# Altium schematic sheet Sourse.SchDoc
size A4
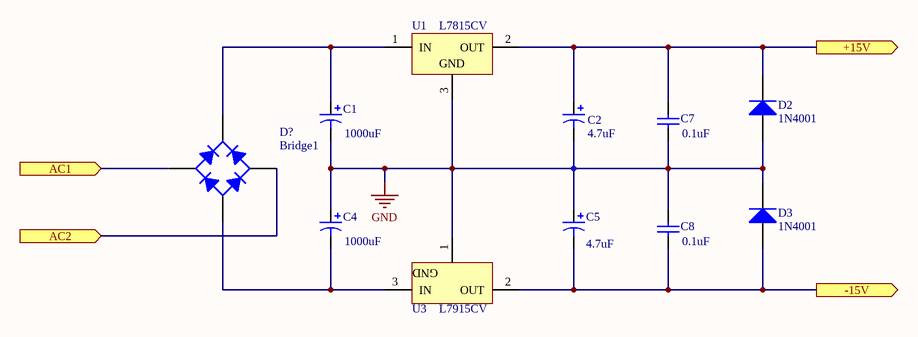
[diagram p0: Sourse.SchDoc]

## Parts
C1  value 1000uF  [RB7.6-15]  (hidden comment: Cap Pol1)
C2  value 4.7uF  [RB7.6-15]  (hidden comment: Cap Pol1)
C4  value 1000uF  [RB7.6-15]  (hidden comment: Cap Pol1)
C5  value 4.7uF  [RB7.6-15]  (hidden comment: Cap Pol1)
C7  value 0.1uF  [RAD-0.3]  (hidden comment: Cap)
C8  value 0.1uF  [RAD-0.3]  (hidden comment: Cap)
D2  1N4001  [DO-41]
D3  1N4001  [DO-41]
D?  Bridge1  [D-38]
U1  L7815CV  [TO220ABN]
U3  L7915CV  [TO220V]

## Ports
+15V (out), -15V (out), AC1 (in), AC2 (in)

## Nets
GND: C1.2 C2.2 C4.1 C5.1 C7.2 C8.1 D2.1(A) D3.2(K) U1.3(GND) U3.1(GND)
+15V: C2.1 C7.1 D2.2(K) U1.2(OUT) ; port +15V
-15V: C5.2 C8.2 D3.1(A) U3.2(OUT) ; port -15V
AC1: D?.2(C) ; port AC1
AC2: D?.4(C) ; port AC2
NetC1_1: C1.1 D?.3(K) U1.1(IN)
NetC4_2: C4.2 D?.1(A) U3.3(IN)

## Library data of the parts
C1 C2 C4 C5 = Cap Pol1: Polarized Capacitor (Radial); Published: 8-Jun-2000; LatestRevisionDate: 17-Jul-2002; LatestRevisionNote: Re-released for DXP Platform.; PackageReference: RB7.6-15; Publisher: Altium Limited
C7 C8 = Cap: Capacitor; Published: 8-Jun-2000; LatestRevisionDate: 17-Jul-2002; LatestRevisionNote: Re-released for DXP Platform.; PackageReference: RAD-0.3; Publisher: Altium Limited
D2 D3 = Diode 1N4001: 1 Amp General Purpose Rectifier; Published: 8-Jun-2000; LatestRevisionDate: 17-Jul-2002; LatestRevisionNote: Re-released for DXP Platform.; DatasheetDocument: 1998; PackageDocument: Aug-1999; PackageReference: DO-41; Publisher: Altium Limited; Code_JEDEC: DO-204-AL; ComponentLink1Description: Manufacturer Link; ComponentLink1URL: http://www.fairchildsemi.com/; ComponentLink2Description: Datasheet; ComponentLink2URL: http://www.fairchildsemi.com/ds/1N%2F1N4001.pdf
D? = Bridge1: Full Wave Diode Bridge; Published: 8-Jun-2000; LatestRevisionDate: 17-Jul-2002; LatestRevisionNote: Re-released for DXP Platform.; PackageReference: D-38; Publisher: Altium Limited
U1 = L7815CV: Positive Voltage Regulator; Note: Tab is connected to pin 3 (GND).; Published: 24-Aug-2001; LatestRevisionDate: 17-Jul-2002; LatestRevisionNote: Re-released for DXP Platform.; DatasheetVersion: Dec-1998; PackageVersion: Jun-1998; PackageReference: TO220ABN; Publisher: Altium Limited; PackageDescription: TO, Thru-Hole, Vertical, Heatsink Mounted; 3 In-Line Leads; Pitch 2.54 mm; Pin sequence 1, 3, 2; ComponentLink1Description: Manufacturer Link; ComponentLink1URL: http://www.st.com/
U3 = L7915CV: Negative Voltage Regulator; Note: Tab is connected to pin 3 (IN).; Published: 24-Aug-2001; LatestRevisionDate: 17-Jul-2002; LatestRevisionNote: Re-released for DXP Platform.; DatasheetVersion: Apr-1997; PackageReference: TO220V; Publisher: Altium Limited; PackageDescription: TO, Thru-Hole, Vertical, Heatsink Mounted; 3 In-Line Leads; Pitch 2.54 mm; Pin sequence 1, 3, 2; ComponentLink1Description: Manufacturer Link; ComponentLink1URL: http://www.st.com/; ComponentLink2Description: Datasheet; ComponentLink2URL: http://www.st.com/stonline/products/literature/ds/2149/l7905c.pdf